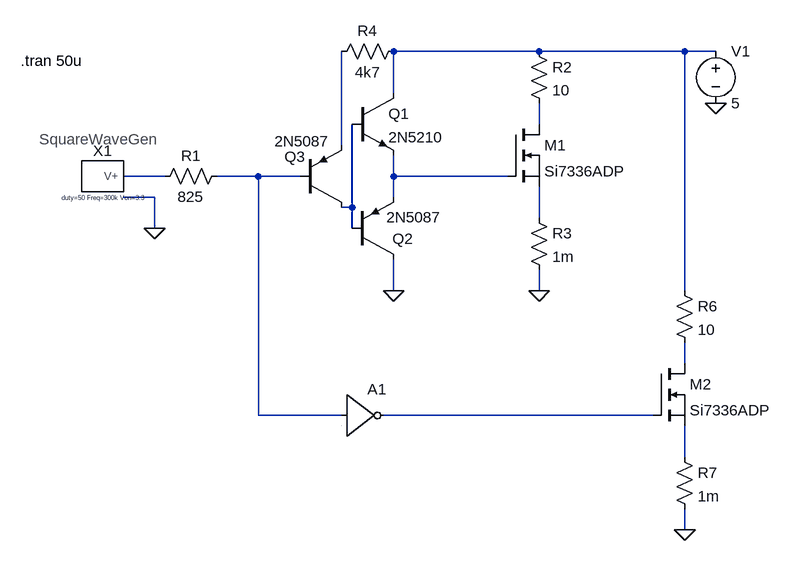
[diagram p0: schematic totempole2.asc]
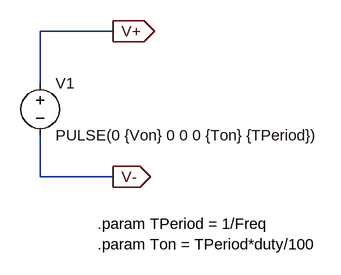
[diagram p1: sub-circuit swgen.asc]
totempole2.asc, the LTspice schematic file:
Version 4
SHEET 1 880 708
WIRE 400 -48 176 -48
WIRE 624 -48 400 -48
WIRE 672 -48 624 -48
WIRE 176 16 176 -48
WIRE 400 64 400 32
WIRE 96 96 96 -48
WIRE -176 144 -240 144
WIRE -32 144 -96 144
WIRE 32 144 -32 144
WIRE 176 144 176 112
WIRE 352 144 176 144
WIRE -192 176 -240 176
WIRE 176 176 176 144
WIRE 112 192 112 64
WIRE 112 192 96 192
WIRE 400 208 400 160
WIRE -192 224 -192 176
WIRE 112 224 112 192
WIRE 176 320 176 272
WIRE 400 320 400 288
WIRE 624 320 624 -48
WIRE 624 432 624 400
WIRE -32 512 -32 144
WIRE 96 512 -32 512
WIRE 576 512 160 512
WIRE 624 576 624 528
WIRE 624 688 624 656
FLAG -192 224 0
FLAG 400 320 0
FLAG 672 32 0
FLAG 176 320 0
FLAG 624 688 0
SYMBOL swgen -272 144 R0
SYMATTR InstName X1
SYMATTR SpiceLine duty=50 Freq=300k Von=3.3
SYMBOL nmos 352 64 R0
SYMATTR InstName M1
SYMATTR Value Si7336ADP
SYMBOL npn 112 16 R0
SYMATTR InstName Q1
SYMATTR Value 2N5210
SYMBOL pnp 112 272 M180
WINDOW 0 62 32 Left 2
WINDOW 3 53 65 Left 2
SYMATTR InstName Q2
SYMATTR Value 2N5087
SYMBOL res -80 128 R90
WINDOW 0 0 56 VBottom 2
WINDOW 3 32 56 VTop 2
SYMATTR InstName R1
SYMATTR Value 825
SYMBOL res 384 -64 R0
SYMATTR InstName R2
SYMATTR Value 10
SYMBOL voltage 672 -64 R0
WINDOW 123 0 0 Left 0
WINDOW 39 0 0 Left 0
SYMATTR InstName V1
SYMATTR Value 5
SYMBOL res 384 192 R0
SYMATTR InstName R3
SYMATTR Value 1m
SYMBOL pnp 32 192 M180
WINDOW 0 -24 78 Left 2
WINDOW 3 -39 102 Left 2
SYMATTR InstName Q3
SYMATTR Value 2N5087
SYMBOL res 192 -64 R90
WINDOW 0 0 56 VBottom 2
WINDOW 3 32 56 VTop 2
SYMATTR InstName R4
SYMATTR Value 4k7
SYMBOL nmos 576 432 R0
SYMATTR InstName M2
SYMATTR Value Si7336ADP
SYMBOL res 608 304 R0
SYMATTR InstName R6
SYMATTR Value 10
SYMBOL res 608 560 R0
SYMATTR InstName R7
SYMATTR Value 1m
SYMBOL Digital\\inv 96 448 R0
SYMATTR InstName A1
TEXT -398 -34 Left 2 !.tran 50u

swgen.asc, the sub-circuit schematic file:
Version 4
SHEET 1 880 680
WIRE 208 16 96 16
WIRE 96 96 96 16
WIRE 96 240 96 176
WIRE 208 240 96 240
FLAG 208 16 V+
IOPIN 208 16 Out
FLAG 208 240 V-
IOPIN 208 240 Out
SYMBOL voltage 96 80 R0
WINDOW 123 0 0 Left 0
WINDOW 39 0 0 Left 0
SYMATTR InstName V1
SYMATTR Value PULSE(0 {Von} 0 0 0 {Ton} {TPeriod})
TEXT 184 312 Left 2 !.param TPeriod = 1/Freq
TEXT 184 344 Left 2 !.param Ton = TPeriod*duty/100

The netlist it stands for:
* totempole2.asc
XX1 N004 swgen params: duty=50 Freq=300k Von=3.3
M1 N002 N006 N008 N008 Si7336ADP
Q1 N001 N007 N006 0 2N5210
Q2 0 N007 N006 0 2N5087
R1 N005 N004 825
R2 N001 N002 10
V1 N001 0 5
R3 N008 0 1m
Q3 N007 N005 N003 0 2N5087
R4 N001 N003 4k7
M2 N009 N010 N011 N011 Si7336ADP
R6 N001 N009 10
R7 N011 0 1m
A1 N005 0 0 0 0 N010 0 0 BUF

* block symbol definitions
.subckt swgen V+
V1 V+ V- PULSE(0 {Von} 0 0 0 {Ton} {TPeriod})
.param TPeriod = 1/Freq
.param Ton = TPeriod*duty/100
.ends swgen

.model NPN NPN
.model PNP PNP
.lib standard.bjt
.model NMOS NMOS
.model PMOS PMOS
.lib standard.mos
.tran 50u
.backanno
.end